# EasyEDA schematic sch_light_rgb.json
TITLE: Light_RGB_V1; REV: 1.0; Date: 2021-01-12; Sheet: 1/1; Drawn By: Juan Carlos Del Rio; Company: DTech
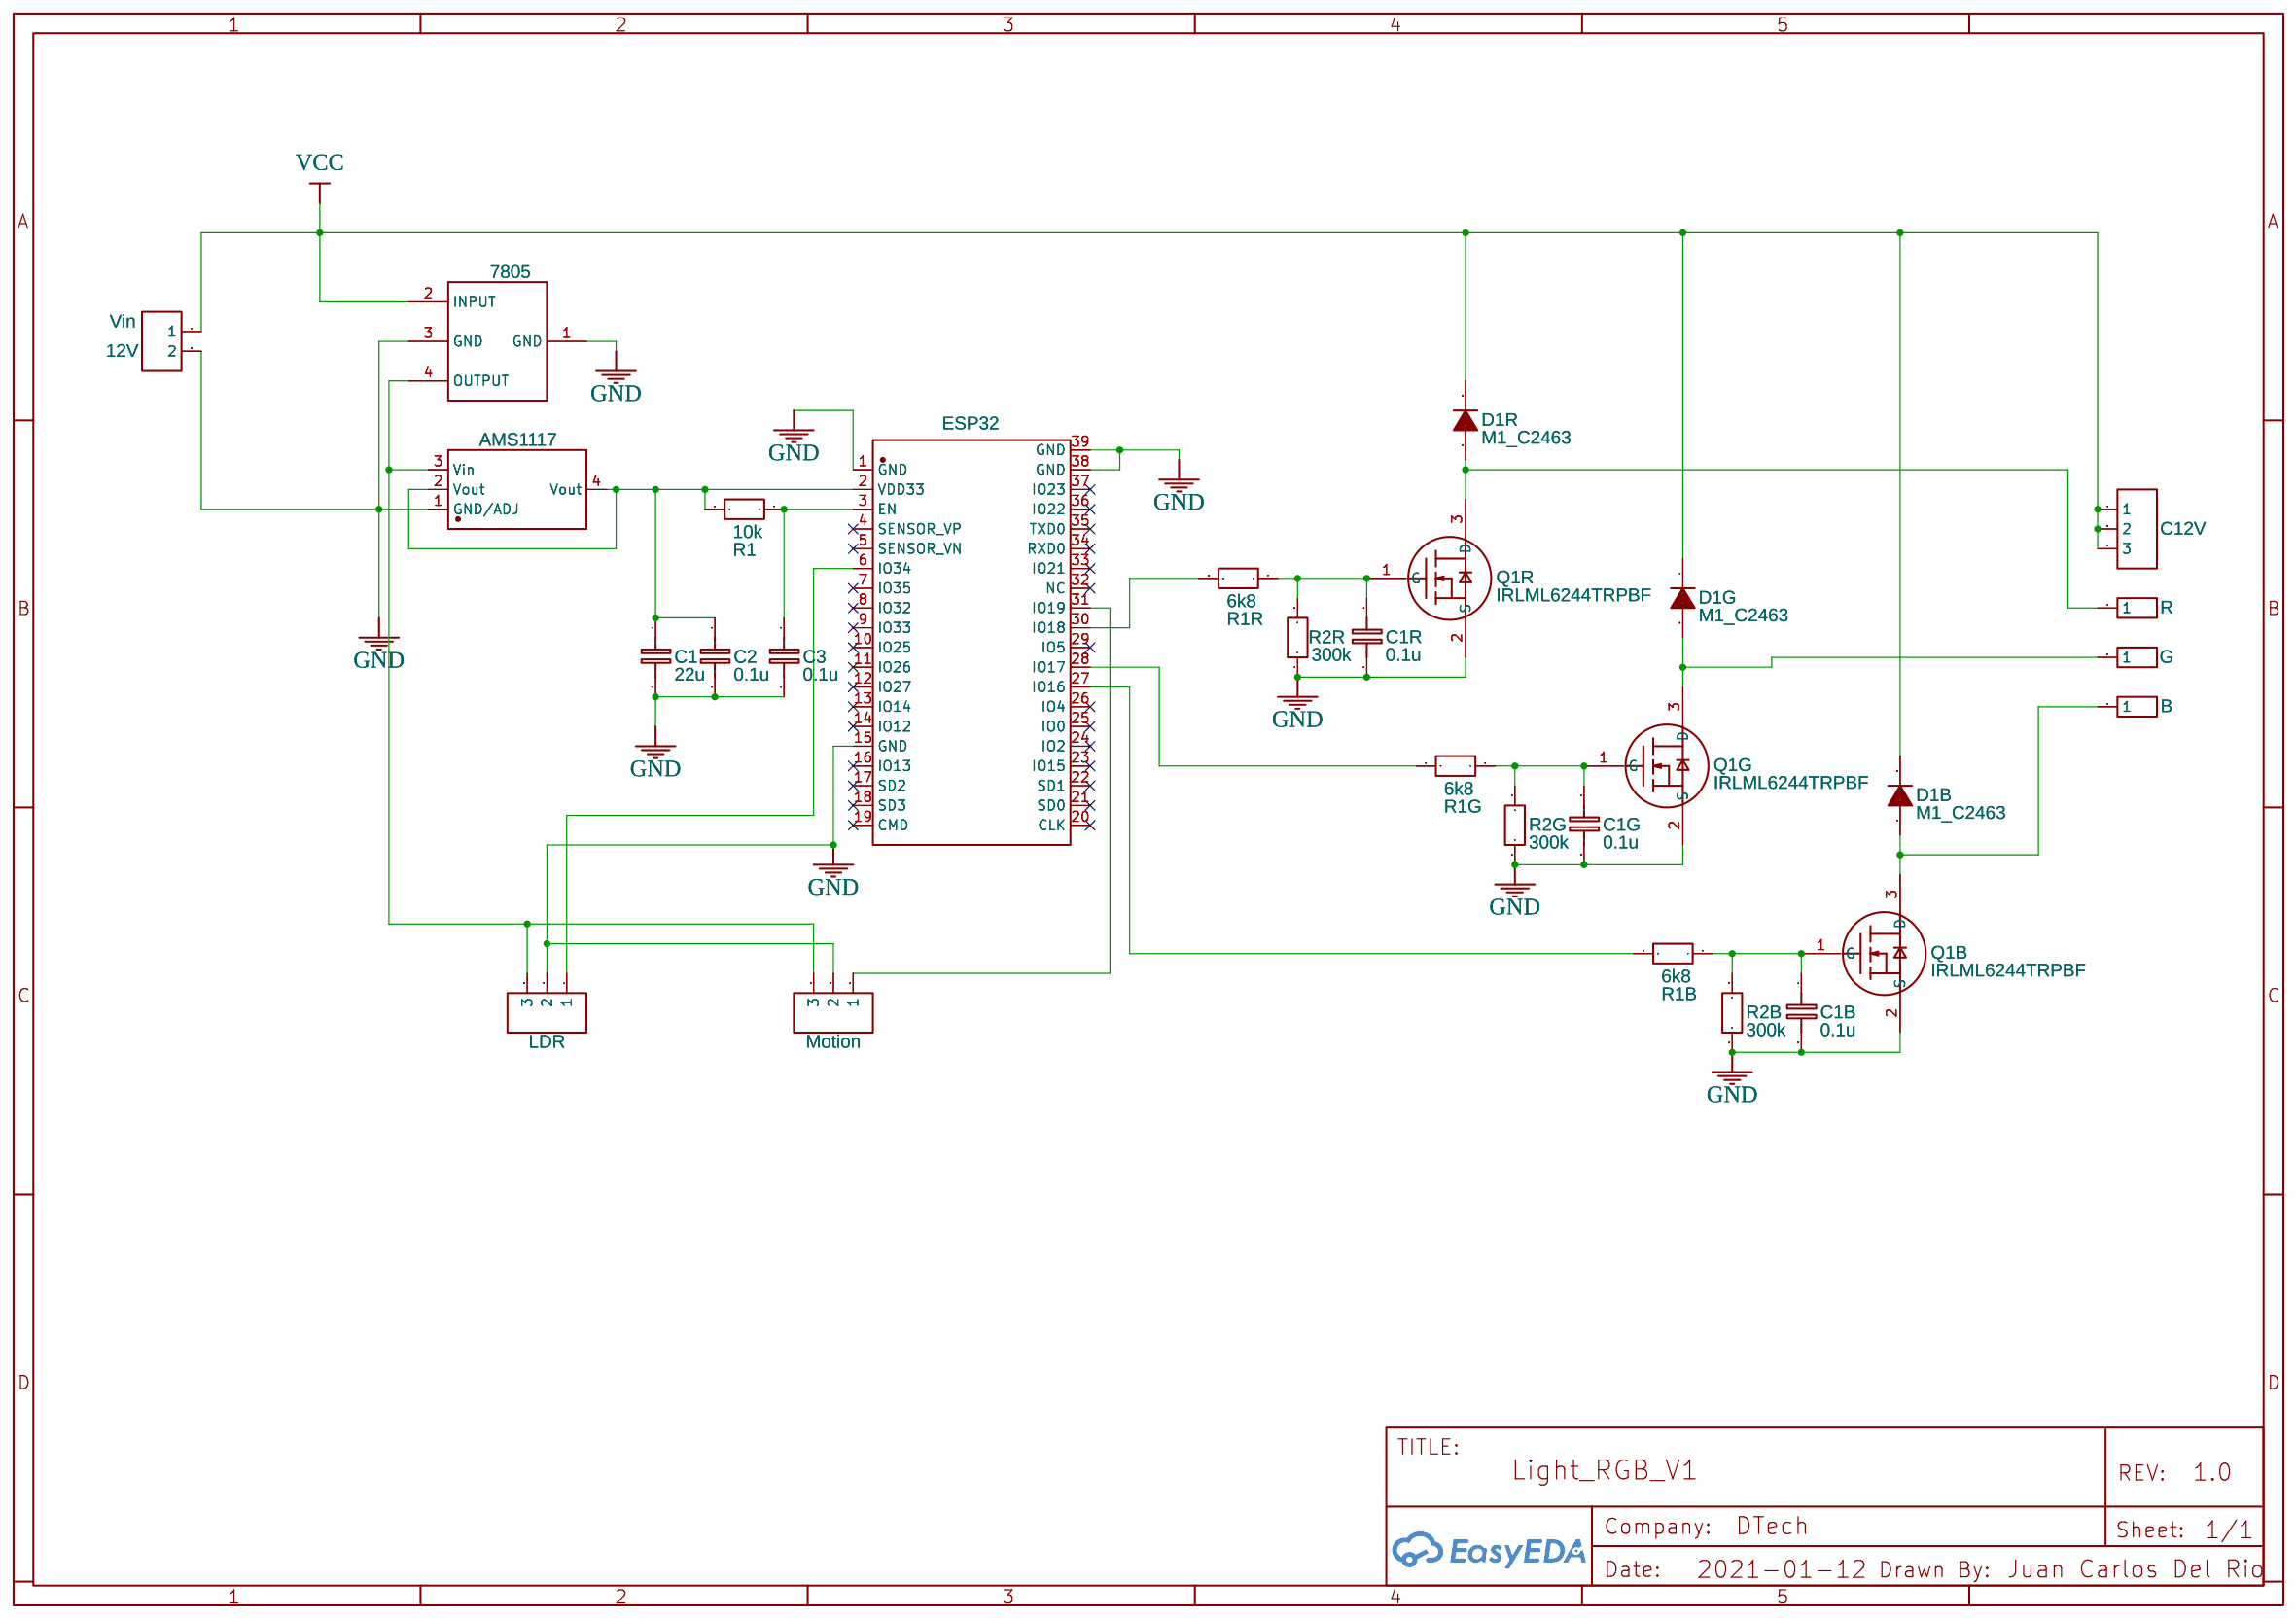
[diagram p0: schematic sheet]

## Parts
12V  Vin  [HDR-F-2.54_1X2]
7805  LM7805 SOT223-4  [LM7805 SOT223-4]
AMS1117  AMS1117-3.3  [SOT-223-3_L6.5-W3.4-P2.30-LS7.0-BR]
B  B  [HDR-M-2.54_1X1]
C1  22u  [C0805]
C1B  0.1u  [C0805]
C1G  0.1u  [C0805]
C1R  0.1u  [C0805]
C2  0.1u  [C0805]
C3  0.1u  [C0805]
C12V  C12V  [HDR-F-2.54_1X3]
D1B  M1_C2463  [SMA_L4.3-W2.6-LS5.2-RD]
D1G  M1_C2463  [SMA_L4.3-W2.6-LS5.2-RD]
D1R  M1_C2463  [SMA_L4.3-W2.6-LS5.2-RD]
ESP32  ESP32-WROOM-32  [WIFIM-SMD_39P-L25.5-W18.0-P1.27]
G  G  [HDR-M-2.54_1X1]
LDR  LDR  [HDR-F-2.54_1X3]
MOTION  Motion  [HDR-F-2.54_1X3]
Q1B  IRLML6244TRPBF  [SOT-23-3_L2.9-W1.3-P1.90-LS2.4-BR]
Q1G  IRLML6244TRPBF  [SOT-23-3_L2.9-W1.3-P1.90-LS2.4-BR]
Q1R  IRLML6244TRPBF  [SOT-23-3_L2.9-W1.3-P1.90-LS2.4-BR]
R  R  [HDR-M-2.54_1X1]
R1  10k  [R1206]
R1B  6k8  [R1206]
R1G  6k8  [R1206]
R1R  6k8  [R1206]
R2B  300k  [R1206]
R2G  300k  [R1206]
R2R  300k  [R1206]

## Library data of the parts
12V = HDR-F-2.54_1x2: Supplier Part: C49661; Supplier: LCSC; Contributor: LCEDA_Lib
7805 = LM7805 SOT223-4: Supplier: Digi-Key; link: https://www.digikey.ca/en/products/detail/texas-instruments/LM7805MP-NOPB/6110582; Contributor: junaid97
AMS1117 = AMS1117-3.3: sourceId: dwIGgezVh; Supplier: LCSC; Manufacturer: AMS; image: //image.lceda.cn/szlcsc/C6186.jpg; Supplier Part: C6186; SMT Type: Basic; JLCPCB SMD: Yes; LCSC Assembly: Yes
B G R = HDR-M-2.54_1x1: Supplier Part: C81276; Supplier: LCSC; Contributor: LCEDA_Lib
C1 C1B C1G C1R C2 C3 = C_0805_EU: Contributor: LCEDA_Lib
C12V LDR MOTION = HDR-F-2.54_1x3: Supplier Part: C146690; Supplier: LCSC; Contributor: LCEDA_Lib
D1B D1G D1R = M1_C2463: Supplier: LCSC; Manufacturer: MDD; Manufacturer Part: M1; image: //image.lceda.cn/szlcsc/C2463.jpg; Supplier Part: C2463; SMT Type: Extend; JLCPCB SMD: Yes; LCSC Assembly: Yes
ESP32 = ESP32-WROOM-32: Supplier: LCSC; Supplier Part: C503587; Manufacturer: Espressif Systems; Contributor: LCSC
Q1B Q1G Q1R = IRLML6244TRPBF: Supplier: LCSC; Manufacturer: Infineon; Contributor: LCSC; Supplier Part: C143946; SMT Type: Extend; JLCPCB SMD: Yes; LCSC Assembly: Yes
R1 R1B R1G R1R R2B R2G R2R = R_1206_EU: Contributor: LCEDA_Lib

## Nets
GND: 12V.2 7805.1(GND) 7805.3(GND) AMS1117.1(GND/ADJ) C1.2 C1B.2 C1G.2 C1R.2 C2.2 C3.2 ESP32.1(GND) ESP32.15(GND) ESP32.38(GND) ESP32.39(GND) LDR.2 MOTION.2 Q1B.2(S) Q1G.2(S) Q1R.2(S) R2B.1 R2G.1 R2R.1
VCC: 12V.1 7805.2(INPUT) C12V.1 C12V.2 C12V.3 D1B.1(K) D1G.1(K) D1R.1(K)
Net-(7805-4): 7805.4(OUTPUT) AMS1117.3(Vin) LDR.3 MOTION.3
Net-(AMS1117-2): AMS1117.2(Vout) AMS1117.4(Vout) C1.1 C2.1 ESP32.2(VDD33) R1.2
Net-(B-1): B.1 D1B.2(A) Q1B.3(D)
Net-(C1B-1): C1B.1 Q1B.1(G) R1B.1 R2B.2
Net-(C1G-1): C1G.1 Q1G.1(G) R1G.1 R2G.2
Net-(C1R-1): C1R.1 Q1R.1(G) R1R.1 R2R.2
Net-(C3-1): C3.1 ESP32.3(EN) R1.1
Net-(D1G-2): D1G.2(A) G.1 Q1G.3(D)
Net-(D1R-2): D1R.2(A) Q1R.3(D) R.1
Net-(ESP32-6): ESP32.6(IO34) LDR.1
Net-(ESP32-27): ESP32.27(IO16) R1B.2
Net-(ESP32-28): ESP32.28(IO17) R1G.2
Net-(ESP32-30): ESP32.30(IO18) R1R.2
Net-(ESP32-31): ESP32.31(IO19) MOTION.1

Not connected (* = marked no-connect by the designer): ESP32 4(SENSOR_VP)* 5(SENSOR_VN)* 7(IO35)* 8(IO32)* 9(IO33)* 10(IO25)* 11(IO26)* 12(IO27)* 13(IO14)* 14(IO12)* 16(IO13)* 17(SD2)* 18(SD3)* 19(CMD)* 20(CLK)* 21(SD0)* 22(SD1)* 23(IO15)* 24(IO2)* 25(IO0)* 26(IO4)* 29(IO5)* 32(NC)* 33(IO21)* 34(RXD0)* 35(TXD0)* 36(IO22)* 37(IO23)*
